# Altium schematic sheet Control_Motor.SchDoc: Control_Motor
size A4; SheetNumber: 1; SheetTotal: 6
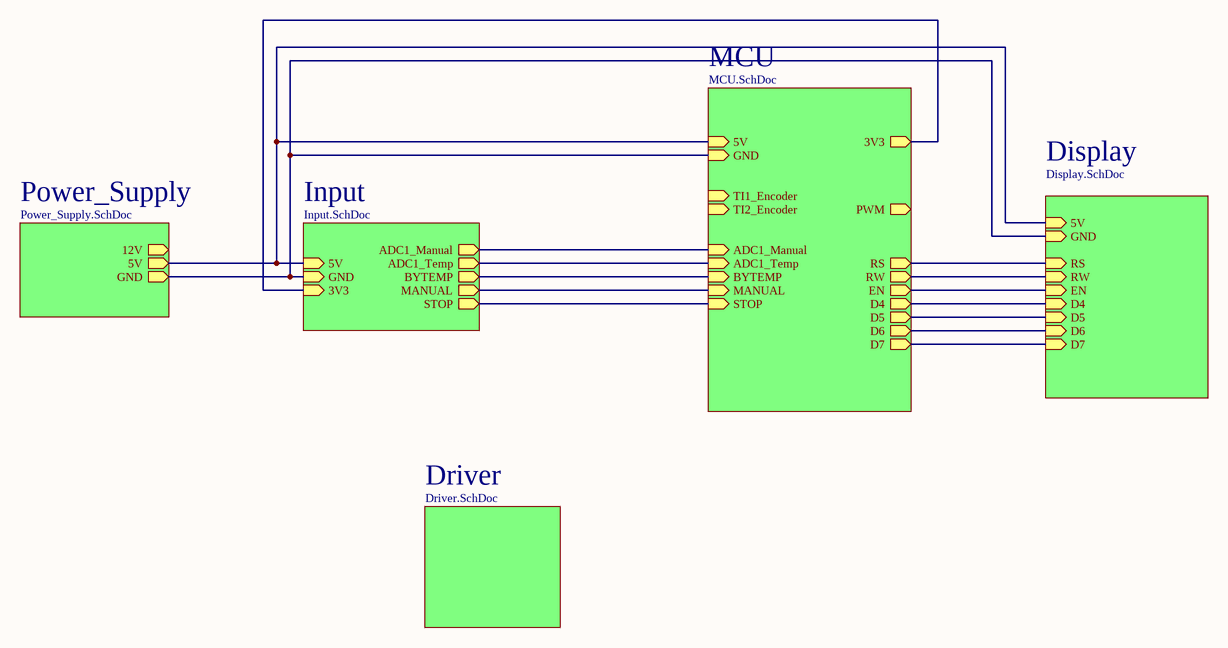
[diagram p0: Control_Motor.SchDoc]

## Sub-sheets
Display = Display.SchDoc: 5V (in), GND (in), RS (in), RW (in), EN (in), D4 (in), D5 (in), D6 (in), D7 (in)
Driver = Driver.SchDoc: no entries
Input = Input.SchDoc: 5V (in), GND (in), ADC1_Temp (out), BYTEMP (out), MANUAL (out), STOP (out), 3V3 (in), ADC1_Manual (out)
MCU = MCU.SchDoc: 5V (in), GND (in), TI1_Encoder (in), BYTEMP (in), TI2_Encoder (in), MANUAL (in), ADC1_Temp (in), STOP (in), ADC1_Manual (in), PWM (out), RS (out), RW (out), EN (out), D5 (out), D4 (out), D6 (out), D7 (out), 3V3 (out)
Power_Supply = Power_Supply.SchDoc: 12V (out), GND (out), 5V (out)

## Nets
(unnamed): sheet Power_Supply/GND, sheet Input/GND, sheet MCU/GND, sheet Display/GND
(unnamed): sheet Power_Supply/5V, sheet Input/5V, sheet MCU/5V, sheet Display/5V
(unnamed): sheet Input/ADC1_Temp, sheet MCU/ADC1_Temp
(unnamed): sheet Input/BYTEMP, sheet MCU/BYTEMP
(unnamed): sheet Input/MANUAL, sheet MCU/MANUAL
(unnamed): sheet Input/STOP, sheet MCU/STOP
(unnamed): sheet Input/3V3, sheet MCU/3V3
(unnamed): sheet Input/ADC1_Manual, sheet MCU/ADC1_Manual
(unnamed): sheet MCU/RS, sheet Display/RS
(unnamed): sheet MCU/RW, sheet Display/RW
(unnamed): sheet MCU/EN, sheet Display/EN
(unnamed): sheet MCU/D5, sheet Display/D5
(unnamed): sheet MCU/D4, sheet Display/D4
(unnamed): sheet MCU/D6, sheet Display/D6
(unnamed): sheet MCU/D7, sheet Display/D7

## Notes on the sheet
- Document Title:
- ĐH BKHN
- Project Name:
- Size:
- A4
- Reviewer:
- Designer:
- Nguyen Ba Hoang
- Revision:
- 1 Dai Co Viet Street
- Bach Khoa, Hai Ba Trung
- Ha Noi
- File:
- Sheet:
- of
- Date: